# EAGLE design bblan95xx (EAGLE 7.6.0)
CNAME: LAN95XX base board adapter; CREVISION: Rev. 0.1 alpha; DESIGNER: Stephan Baerwolf
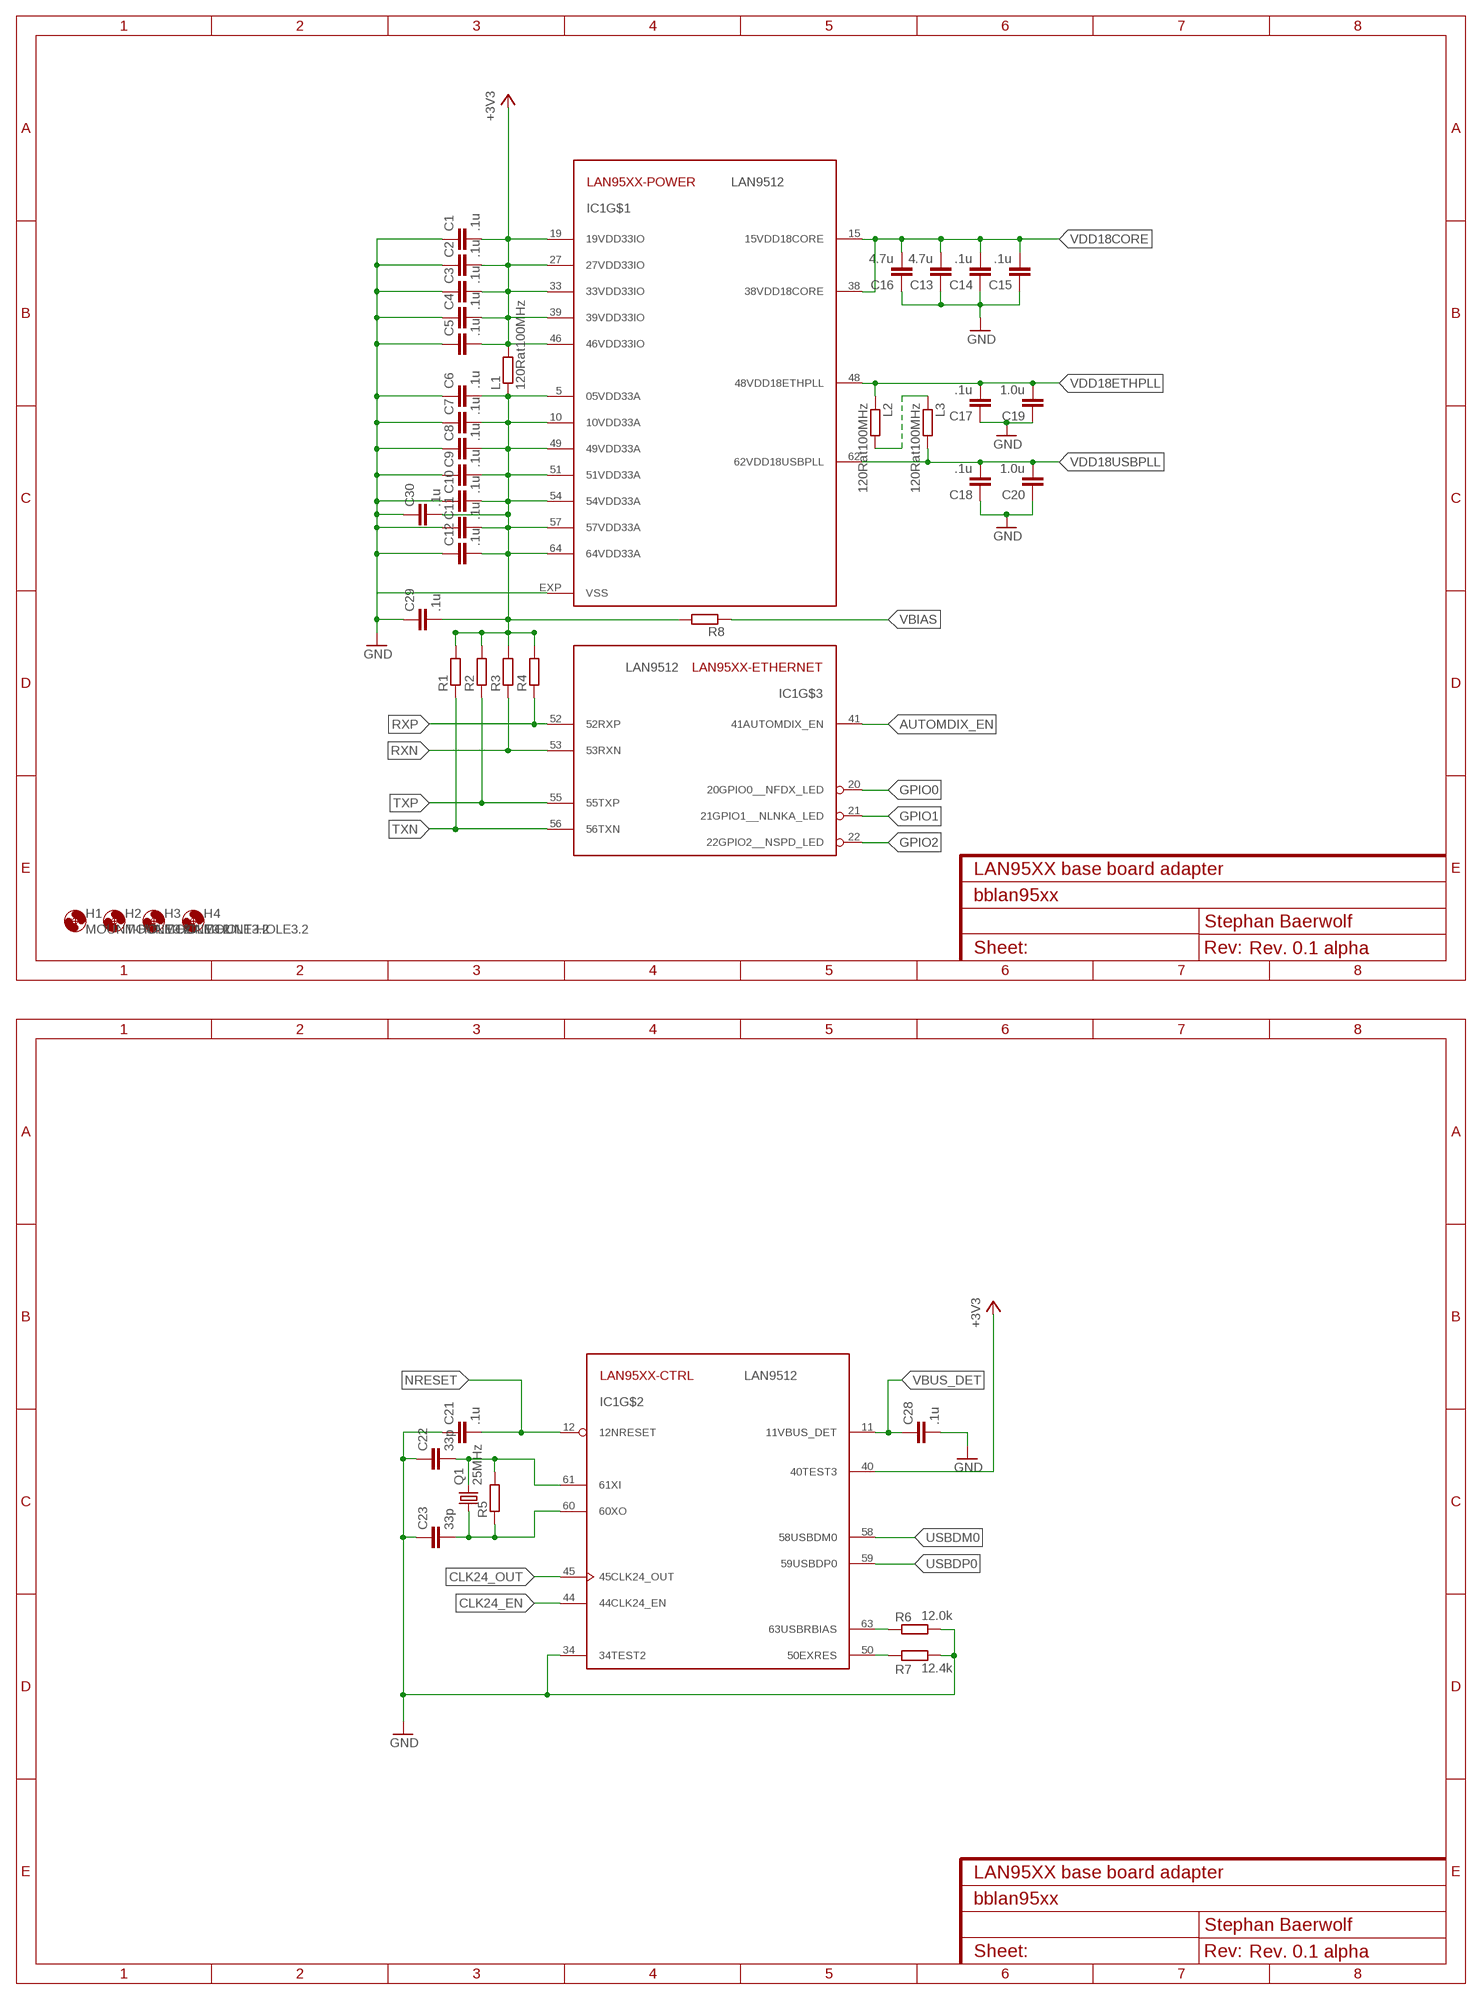
[diagram p0: schematic, sheet 1, part 1 of 2]
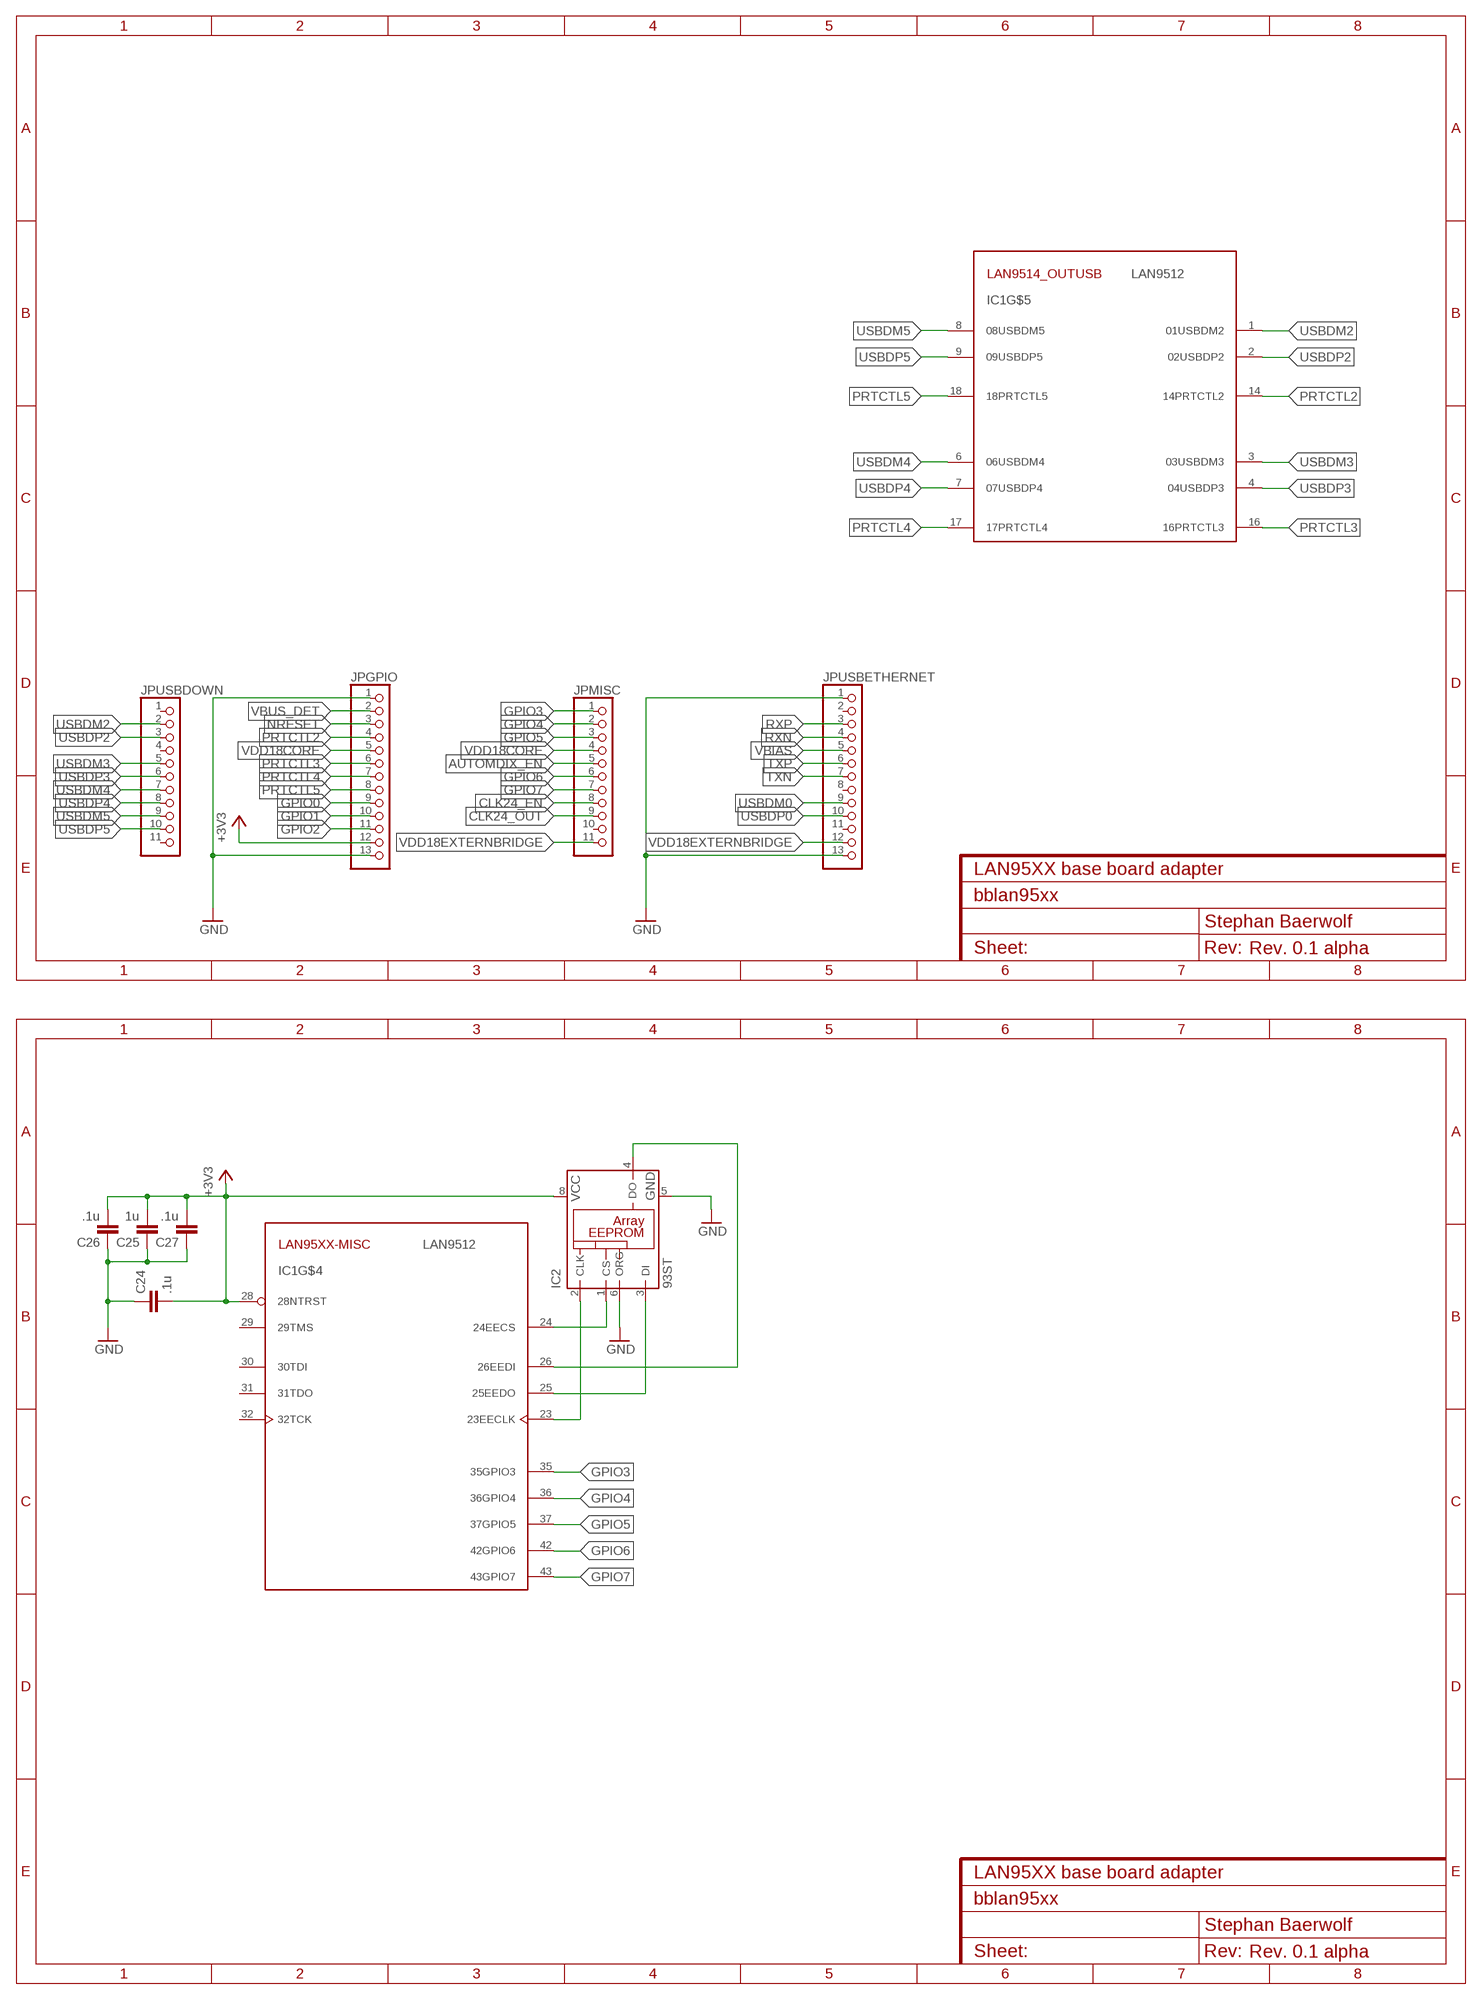
[diagram p1: schematic, sheet 1, part 2 of 2]
FRAME1 (FRAME-A4L): MYSHEET: 1/4
FRAME2 (FRAME-A4L): MYSHEET: 2/4
FRAME3 (FRAME-A4L): MYSHEET: 3/4
FRAME4 (FRAME-A4L): MYSHEET: 4/4

## Parts
C1  .1u  C-EUC0805K  [C0805K]
C2  .1u  C-EUC0805K  [C0805K]
C3  .1u  C-EUC0805K  [C0805K]
C4  .1u  C-EUC0805K  [C0805K]
C5  .1u  C-EUC0805K  [C0805K]
C6  .1u  C-EUC0805K  [C0805K]
C7  .1u  C-EUC0805K  [C0805K]
C8  .1u  C-EUC0805K  [C0805K]
C9  .1u  C-EUC0603K  [C0603K]
C10  .1u  C-EUC0603K  [C0603K]
C11  .1u  C-EUC0603K  [C0603K]
C12  .1u  C-EUC0805K  [C0805K]
C13  4.7u  C-EUC0805K  [C0805K]
C14  .1u  C-EUC0603K  [C0603K]
C15  .1u  C-EUC0603K  [C0603K]
C16  4.7u  C-EUC0805K  [C0805K]
C17  .1u  C-EUC0603K  [C0603K]
C18  .1u  C-EUC0603K  [C0603K]
C19  1.0u  C-EUC0805K  [C0805K]
C20  1.0u  C-EUC0805K  [C0805K]
C21  .1u  C-EUC0603K  [C0603K]
C22  33p  C-EUC0603K  [C0603K]
C23  33p  C-EUC0603K  [C0603K]
C24  .1u  C-EUC0603K  [C0603K]
C25  1u  C-EUC0805K  [C0805K]
C26  .1u  C-EUC0805K  [C0805K]
C27  .1u  C-EUC0805K  [C0805K]
C28  .1u  C-EUC0603K  [C0603K]
C29  .1u  C-EUC0603K  [C0603K]
C30  .1u  C-EUC0603K  [C0603K]
H1  MOUNT-HOLE3.2  [3,2]
H2  MOUNT-HOLE3.2  [3,2]
H3  MOUNT-HOLE3.2  [3,2]
H4  MOUNT-HOLE3.2  [3,2]
IC1  LAN9512  LAN95XX  [QFN64-9X9-EXTRALONG]
IC2  93ST  93LC66SN  [SO-08]
JPGPIO  PINHD-1X13  [1X13]
JPMISC  PINHD-1X11  [1X11]
JPUSBDOWN  PINHD-1X11  [1X11]
JPUSBETHERNET  PINHD-1X13  [1X13]
L1  120Rat100MHz  R-EU_R0805  [R0805]
L2  120Rat100MHz  R-EU_R0805  [R0805]
L3  120Rat100MHz  R-EU_R0805  [R0805]
Q1  25MHz  CRYSTAL5X3  [CRYSTAL-SMD-5X3]
R1  R-EU_R0603  [R0603]
R2  R-EU_R0603  [R0603]
R3  R-EU_R0603  [R0603]
R4  R-EU_R0603  [R0603]
R5  R-EU_R0603  [R0603]
R6  12.0k  R-EU_R0603  [R0603]
R7  12.4k  R-EU_R0603  [R0603]
R8  R-EU_R0402  [R0402]

## Nets
+3V3: C1.2 C2.2 C3.2 C4.2 C5.2 C24.2 C25.2 C26.2 C27.2 IC1.19(19VDD33IO) IC1.27(27VDD33IO) IC1.28(28NTRST) IC1.33(33VDD33IO) IC1.39(39VDD33IO) IC1.40(40TEST3) IC1.46(46VDD33IO) IC2.8(VCC) JPGPIO.12 L1.2
AUTOMDIX_EN: IC1.41(41AUTOMDIX_EN) JPMISC.5
CLK24_EN: IC1.44(44CLK24_EN) JPMISC.8
CLK24_OUT: IC1.45(45CLK24_OUT) JPMISC.9
EECLK: IC1.23(23EECLK) IC2.2(CLK)
EECS: IC1.24(24EECS) IC2.1(CS)
EEDI: IC1.26(26EEDI) IC2.4(DO)
EEDO: IC1.25(25EEDO) IC2.3(DI)
GND: C1.1 C2.1 C3.1 C4.1 C5.1 C6.1 C7.1 C8.1 C9.1 C10.1 C11.1 C12.1 C13.1 C14.1 C15.1 C16.1 C17.1 C18.1 C19.1 C20.1 C21.1 C22.1 C23.1 C24.1 C25.1 C26.1 C27.1 C28.2 C29.1 C30.1 IC1.34(34TEST2) IC1.EXP(VSS) IC2.5(GND) IC2.6(ORG) JPGPIO.1 JPGPIO.13 JPUSBETHERNET.1 JPUSBETHERNET.13 R6.2 R7.2
GPIO0: IC1.20(20GPIO0__NFDX_LED) JPGPIO.9
GPIO1: IC1.21(21GPIO1__NLNKA_LED) JPGPIO.10
GPIO2: IC1.22(22GPIO2__NSPD_LED) JPGPIO.11
GPIO3: IC1.35(35GPIO3) JPMISC.1
GPIO4: IC1.36(36GPIO4) JPMISC.2
GPIO5: IC1.37(37GPIO5) JPMISC.3
GPIO6: IC1.42(42GPIO6) JPMISC.6
GPIO7: IC1.43(43GPIO7) JPMISC.7
N$5: IC1.63(63USBRBIAS) R6.1
N$6: IC1.50(50EXRES) R7.1
NRESET: C21.2 IC1.12(12NRESET) JPGPIO.3
PRTCTL2: IC1.14(14PRTCTL2) JPGPIO.4
PRTCTL3: IC1.16(16PRTCTL3) JPGPIO.6
PRTCTL4: IC1.17(17PRTCTL4) JPGPIO.7
PRTCTL5: IC1.18(18PRTCTL5) JPGPIO.8
RXN: IC1.53(53RXN) JPUSBETHERNET.4 R3.1
RXP: IC1.52(52RXP) JPUSBETHERNET.3 R4.1
TXN: IC1.56(56TXN) JPUSBETHERNET.7 R1.1
TXP: IC1.55(55TXP) JPUSBETHERNET.6 R2.1
USBDM0: IC1.58(58USBDM0) JPUSBETHERNET.9
USBDM2: IC1.1(01USBDM2) JPUSBDOWN.2
USBDM3: IC1.3(03USBDM3) JPUSBDOWN.5
USBDM4: IC1.6(06USBDM4) JPUSBDOWN.7
USBDM5: IC1.8(08USBDM5) JPUSBDOWN.9
USBDP0: IC1.59(59USBDP0) JPUSBETHERNET.10
USBDP2: IC1.2(02USBDP2) JPUSBDOWN.3
USBDP3: IC1.4(04USBDP3) JPUSBDOWN.6
USBDP4: IC1.7(07USBDP4) JPUSBDOWN.8
USBDP5: IC1.9(09USBDP5) JPUSBDOWN.10
VBIAS: JPUSBETHERNET.5 R8.1
VBUS_DET: C28.1 IC1.11(11VBUS_DET) JPGPIO.2
VDD18CORE: C13.2 C14.2 C15.2 C16.2 IC1.15(15VDD18CORE) IC1.38(38VDD18CORE) JPGPIO.5 JPMISC.4
VDD18ETHPLL: C17.2 C19.2 IC1.48(48VDD18ETHPLL) L2.1
VDD18EXTERNBRIDGE: JPMISC.11 JPUSBETHERNET.12 L2.2 L3.1
VDD18USBPLL: C18.2 C20.2 IC1.62(62VDD18USBPLL) L3.2
VDD33A: C6.2 C7.2 C8.2 C9.2 C10.2 C11.2 C12.2 C29.2 C30.2 IC1.5(05VDD33A) IC1.10(10VDD33A) IC1.49(49VDD33A) IC1.51(51VDD33A) IC1.54(54VDD33A) IC1.57(57VDD33A) IC1.64(64VDD33A) L1.1 R1.2 R2.2 R3.2 R4.2 R8.2
XI: C22.2 IC1.61(61XI) Q1.3 R5.2
XO: C23.2 IC1.60(60XO) Q1.1 R5.1
Unconnected: IC1.29(29TMS) IC1.30(30TDI) IC1.31(31TDO) IC1.32(32TCK) IC2.7(NU) JPMISC.10 JPUSBDOWN.1 JPUSBDOWN.4 JPUSBDOWN.11 JPUSBETHERNET.2 JPUSBETHERNET.8 JPUSBETHERNET.11

## Library data of the parts
C1-C30 = resistor:C-EU: CAPACITOR, European symbol; SPICEPREFIX: C
H1-H4 = holes:MOUNT-HOLE: MOUNTING HOLE with drill center marker
IC1 = LAN95XX:LAN95XX
IC2 = microchip:93*: Serial EPROM 1 K/2 K/4 K, low voltage, Microwire; MF: MICROCHIP; MPN: 93LC66/SN; OC_FARNELL: 1296586; OC_NEWARK: 65K1154
JPGPIO JPUSBETHERNET = pinhead:PINHD-1X13: PIN HEADER
JPMISC JPUSBDOWN = pinhead:PINHD-1X11: PIN HEADER
L1-L3 R1-R8 = resistor:R-EU_: RESISTOR, European symbol; SPICEPREFIX: R
Q1 = SparkFun:CRYSTAL: Crystals Various standard crystals. Proven footprints. Spark Fun Electronics SKU : COM-00534

## Board
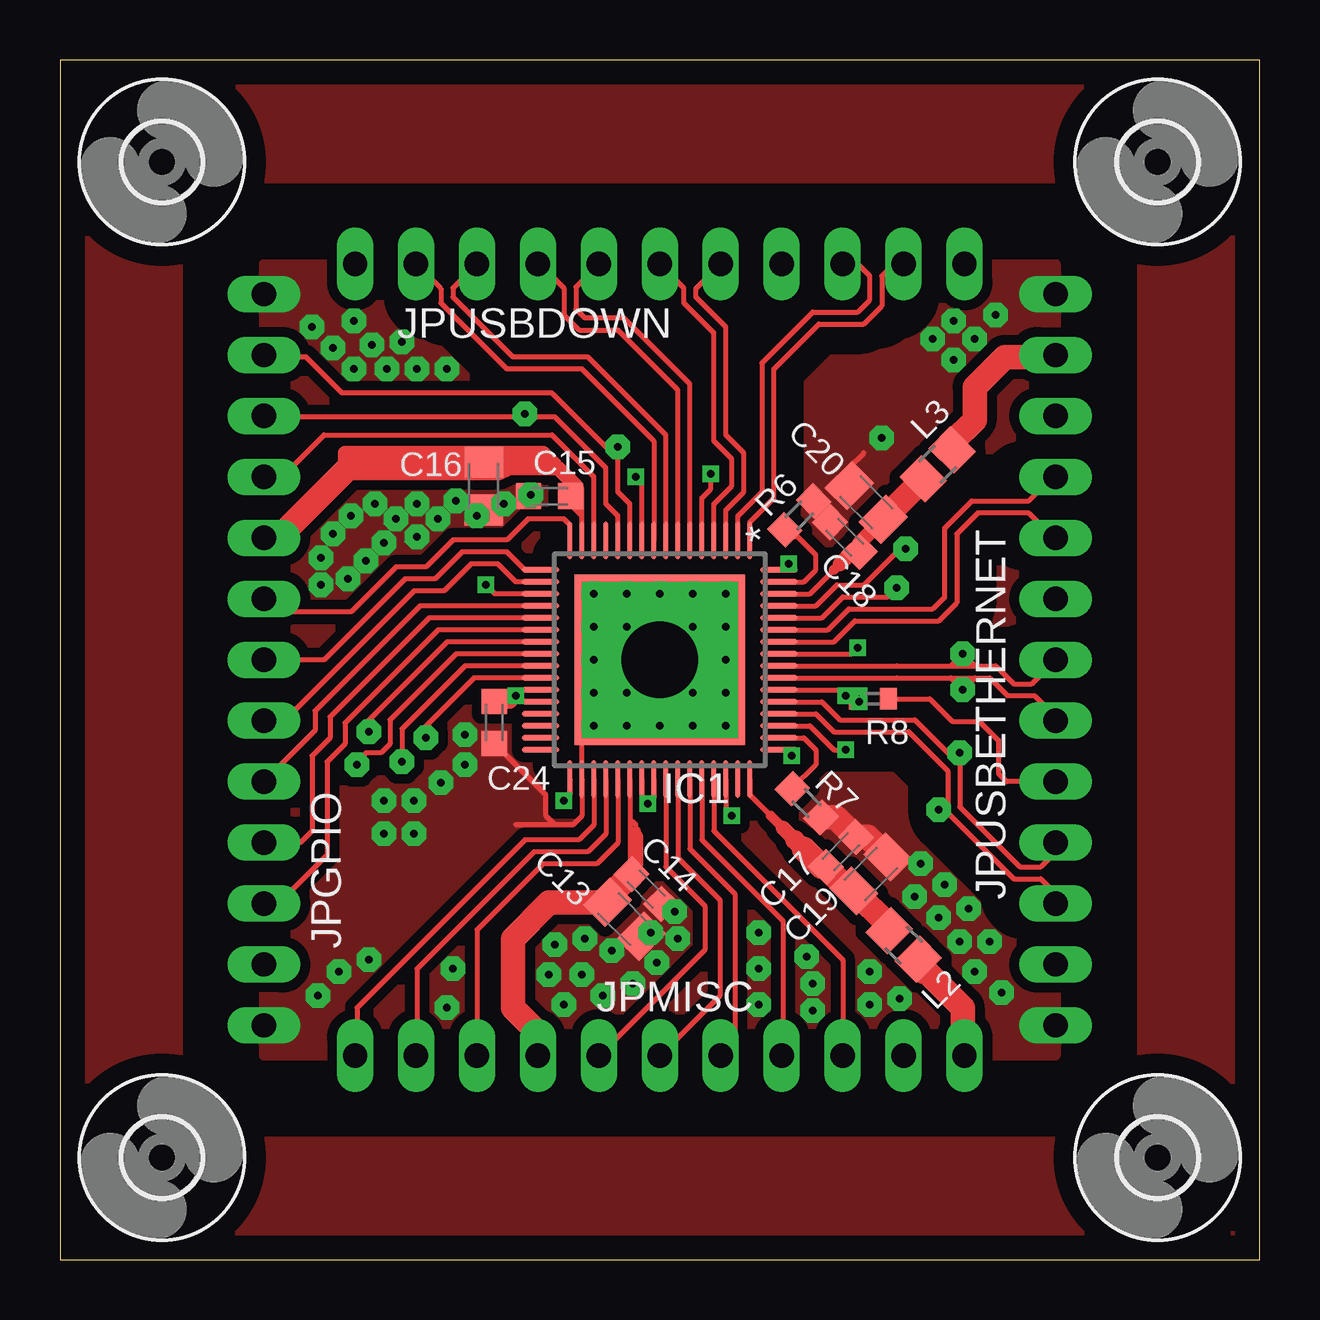
[diagram p2: board, top side]
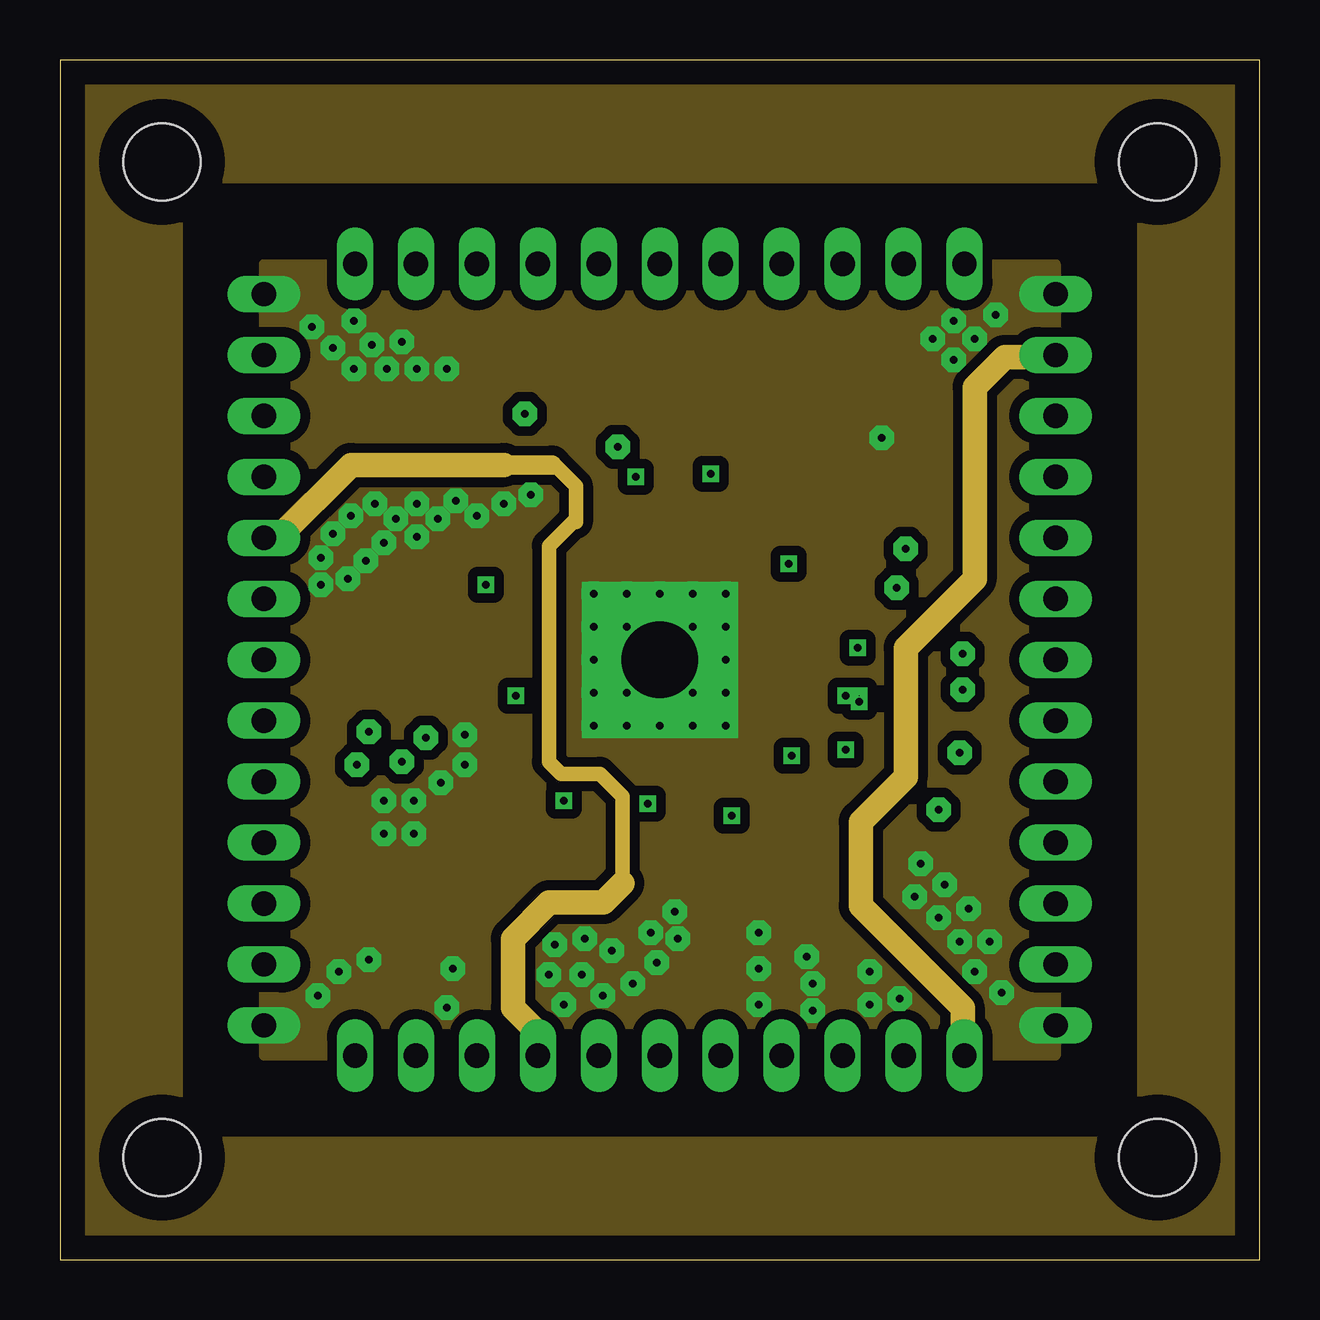
[diagram p3: board, inner layer PCBnoRoute]
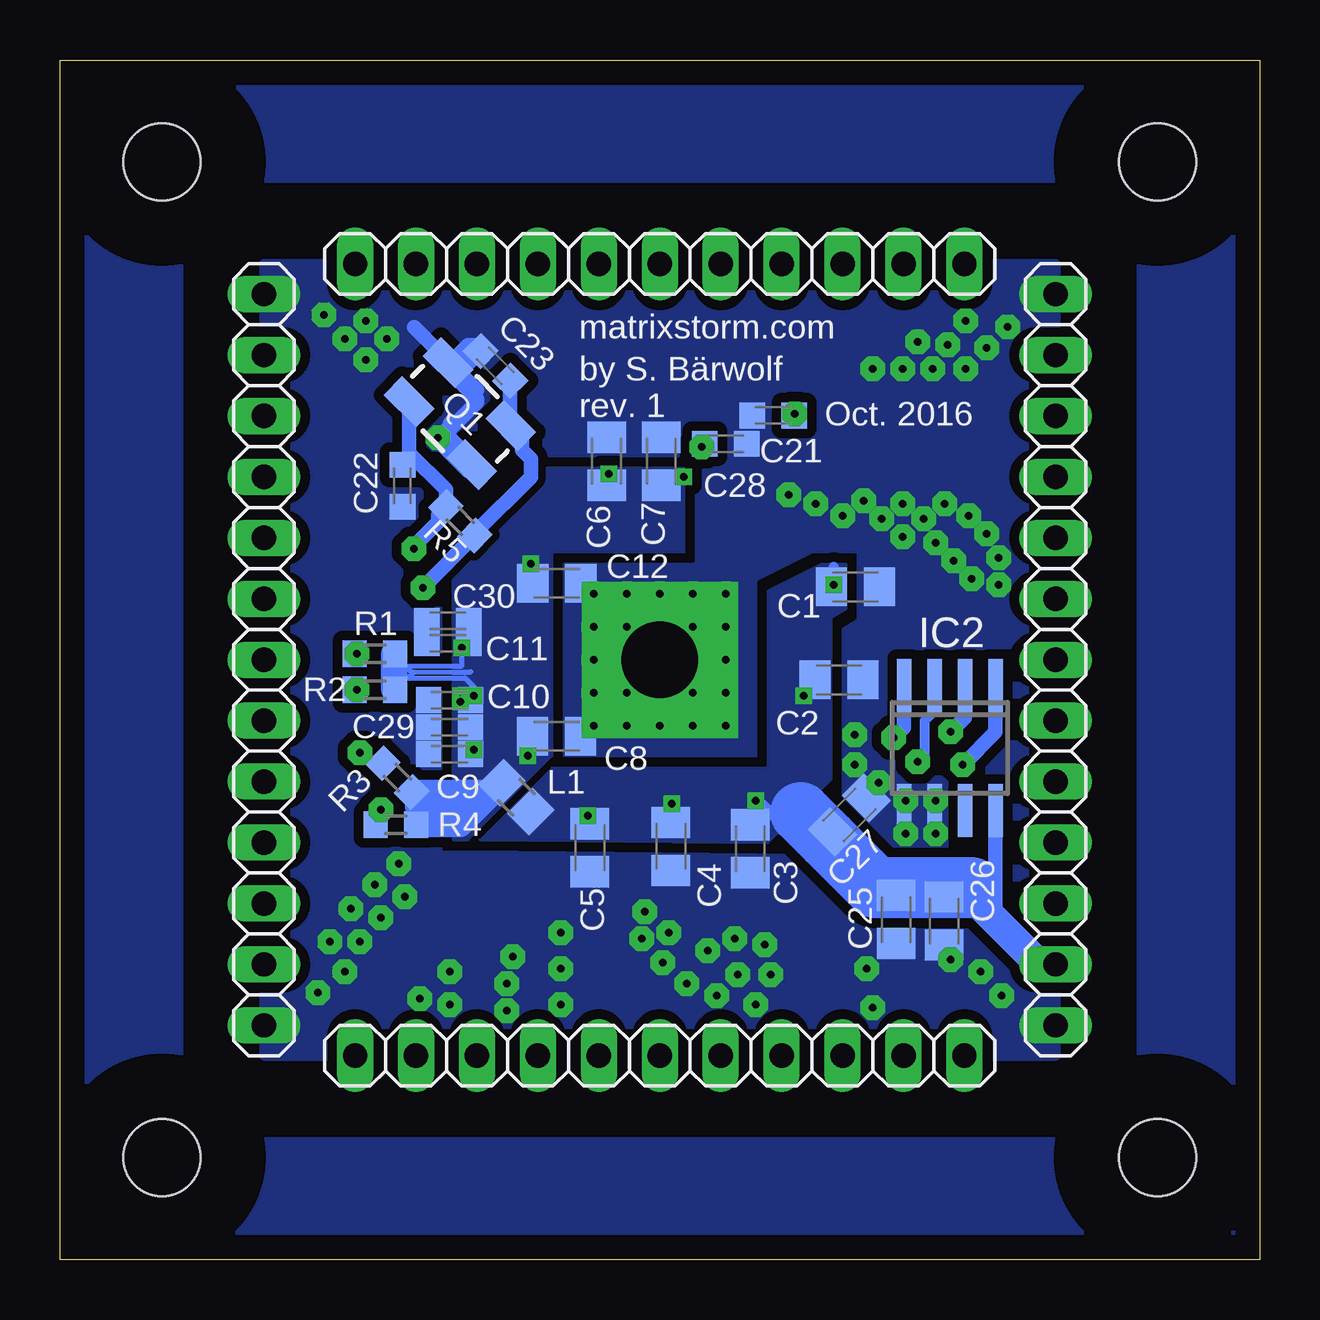
[diagram p4: board, bottom side, seen from below]

Size 50 x 50 mm. Coordinates in mm from the lower left corner, seen from the top.
Outline: 0,0 50,0 50,50 0,50 0,0
Copper layers (1*14*16): Top 0.035mm / dielectric 0.45mm / PCBnoRoute 0.035mm / dielectric 0.15mm / Bottom 0.035mm
Design rules "default *": minimum track width 10mil, minimum drill 24mil, track to track 8mil, track to pad 8mil, pad to pad 8mil, via to via 8mil, smd to smd 8mil, copper to edge 40mil, drill to drill 8mil, minimum pad ring 10mil, minimum via ring 8mil, stop-mask expansion 4mil, vias tented up to drill 0mil, thermal gap 10mil
tRestrict: 52 lines

### Footprints (pad centres in the part's own frame; a part is rotated, then mirrored left to right if it is on the bottom)
C0805K = smd 1.3 x 1.6: 1 -1,0; 2 1,0
C0603K = smd 1.05 x 1.08: 1 -0.875,0; 2 0.875,0
3,2 = hole 3.2: 0,0
QFN64-9X9-EXTRALONG = smd 1.55 x 0.2: 1 -4.977,3.75; 2 -4.977,3.25; 3 -4.977,2.75; 4 -4.977,2.25; 5 -4.977,1.75; 6 -4.977,1.25; 7 -4.977,0.75; 8 -4.977,0.25; 9 -4.977,-0.25; 10 -4.977,-0.75; 11 -4.977,-1.25; 12 -4.977,-1.75; 13 -4.977,-2.25; 14 -4.977,-2.75; 15 -4.977,-3.25; 16 -4.977,-3.75; 33 4.977,-3.75; 34 4.977,-3.25; 35 4.977,-2.75; 36 4.977,-2.25; 37 4.977,-1.75; 38 4.977,-1.25; 39 4.977,-0.75; 40 4.977,-0.25; 41 4.977,0.25; 42 4.977,0.75; 43 4.977,1.25; 44 4.977,1.75; 45 4.977,2.25; 46 4.977,2.75; 47 4.977,3.25; 48 4.977,3.75 | smd 0.2 x 1.55: 17 -3.75,-4.977; 18 -3.25,-4.977; 19 -2.75,-4.977; 20 -2.25,-4.977; 21 -1.75,-4.977; 22 -1.25,-4.977; 23 -0.75,-4.977; 24 -0.25,-4.977; 25 0.25,-4.977; 26 0.75,-4.977; 27 1.25,-4.977; 28 1.75,-4.977; 29 2.25,-4.977; 30 2.75,-4.977; 31 3.25,-4.977; 32 3.75,-4.977; 49 3.75,4.977; 50 3.25,4.977; 51 2.75,4.977; 52 2.25,4.977; 53 1.75,4.977; 54 1.25,4.977; 55 0.75,4.977; 56 0.25,4.977; 57 -0.25,4.977; 58 -0.75,4.977; 59 -1.25,4.977; 60 -1.75,4.977; 61 -2.25,4.977; 62 -2.75,4.977; 63 -3.25,4.977; 64 -3.75,4.977 | smd 7.1 x 7.1: EXP 0,0
SO-08 = smd 0.6 x 2.2: 1 -1.905,-2.6; 2 -0.635,-2.6; 3 0.635,-2.6; 4 1.905,-2.6; 5 1.905,2.6; 6 0.635,2.6; 7 -0.635,2.6; 8 -1.905,2.6
1X13 = drill 1.016 long: 1 -15.24,0; 2 -12.7,0; 3 -10.16,0; 4 -7.62,0; 5 -5.08,0; 6 -2.54,0; 7 0,0; 8 2.54,0; 9 5.08,0; 10 7.62,0; 11 10.16,0; 12 12.7,0; 13 15.24,0
1X11 = drill 1.016 long: 1 -12.7,0; 2 -10.16,0; 3 -7.62,0; 4 -5.08,0; 5 -2.54,0; 6 0,0; 7 2.54,0; 8 5.08,0; 9 7.62,0; 10 10.16,0; 11 12.7,0
R0805 = smd 1.3 x 1.5: 1 -0.85,0; 2 0.85,0
CRYSTAL-SMD-5X3 = smd 1.9 x 1.1: 1 -1.85,-1.15; 2 1.85,-1.15; 3 1.85,1.15; 4 -1.85,1.15
R0603 = smd 1 x 1.1: 1 -0.85,0; 2 0.85,0
R0402 = smd 0.7 x 0.9: 1 -0.65,0; 2 0.65,0

### Placement (x,y rotation side)
C1  16.84,28.04 180 bottom
C2  17.53,24.16 180 bottom
C3  21.23,17.12 90 bottom
C4  24.54,17.23 90 bottom
C5  27.91,17.16 90 bottom
C6  27.21,33.27 270 bottom
C7  24.94,33.27 270 bottom
C8  29.3,21.81 180 bottom
C9  33.77,21.07 0 bottom
C10  33.77,23.32 0 bottom
C11  33.83,25.69 0 bottom
C12  29.29,28.18 180 bottom
C13  23.52,14.19 135 top
C14  24.44,15.44 135 top
C15  20.41,31.82 0 top
C16  17.66,32.23 90 top
C17  32.55,16.99 225 top
C18  32.71,30.11 315 top
C19  33.8,16.07 225 top
C20  33.61,31.56 315 top
C21  20.27,35.19 0 bottom
C22  35.73,32.25 90 bottom
C23  31.85,37.25 315 bottom
C24  18.11,22.39 90 top
C25  15.14,14.18 90 bottom
C26  13.14,14.11 90 bottom
C27  17.09,18.54 225 bottom
C28  22.25,34 0 bottom
C29  33.77,22.19 0 bottom
C30  33.83,26.62 0 bottom
H1  4.25,45.75 0 top
H2  45.75,45.75 0 top
H3  4.25,4.25 0 top
H4  45.75,4.25 0 top
IC1  25,25 270 top
IC2  12.91,21.32 180 bottom
JPGPIO  8.5,25 270 bottom
JPMISC  25,8.5 180 bottom
JPUSBDOWN  25,41.5 0 bottom
JPUSBETHERNET  41.5,25 90 bottom
L1  30.97,19.27 315 bottom
L2  35.16,13.11 315 top
L3  36.59,33.14 225 top
Q1  33.33,35.26 135 bottom
R1  36.88,25.25 0 bottom
R2  36.88,23.75 0 bottom
R3  35.94,20.09 315 bottom
R4  36,18.12 0 bottom
R5  33.31,30.78 135 bottom
R6  30.81,31.01 45 top
R7  31.12,19.03 315 top
R8  33.88,23.38 180 top

### Tracks (layer width: path | path; a pad name or v marks a point on that pad's centre or on a via)
+3V3  (via drill 0.3)
  Top 0.2: IC1.19 18.12,27.75 v17.75,28.12 | IC1.40 24.75,19.25 v24.5,19 24.25,19.25 IC1.39 | IC1.33 21.25,19.38 v21,19.12 | IC1.46 27.75,18.75 v28,18.5 | IC1.27 19.25,23.75 v19,23.5 19.25,23.25 IC1.28
  Top 0.61: C24.2 18.76,23.26 v19,23.5
  Bottom 0.2: C26.2 12.39,14.98 12,15.38 | C25.2 15.3,15.18 15.62,15.5
  Bottom 0.406: 17.75,28.88 v17.75,28.12
  Bottom 0.61: 19.12,18.62 20.5,18.62 v21,19.12 | IC2.8 11.01,14.74 11.31,14.44 | C27.2 18,17.62 18,17.5 | 17.75,27.82 C1.2
  Bottom 1.27: JPGPIO.12 9.18,12.3 11.31,14.44 12,15.12 12,15.38 12,15.5
  Bottom 2.54: 12,15.5 15.62,15.5 16,15.5 18,17.5 19.12,18.62
  pour Bottom (isolate 0.305, no thermals): 20.5,27.88 18.25,29 17.25,29 17.25,27.12 17.88,26.75 17.88,20 20.5,17.38 32.5,17.5 29.5,20.5 20.5,20.5
AUTOMDIX_EN
  Top 0.2: IC1.41 25.25,16.38 26.88,14.75 26.88,12.91 JPMISC.5
CLK24_EN
  Top 0.2: IC1.44 26.75,17.5 30.12,14.12 30.12,8.54 JPMISC.8
CLK24_OUT
  Top 0.2: IC1.45 27.25,17.88 32.62,12.5 JPMISC.9
EECLK  (via drill 0.3 pad 1.02)
  Top 0.2: IC1.23 16.12,25.75 12.88,22.5 v12.88,22
  Bottom 0.61: IC2.2 12.28,22.6 v12.88,22
EECS  (via drill 0.3 pad 1.02)
  Top 0.2: IC1.24 16.5,25.25 13.75,22.5 13.75,21.5 13.38,21.12 12.75,21.12 12.38,20.75 v12.38,20.62
  Bottom 0.61: IC2.1 11.01,22 v12.38,20.62
EEDI  (via drill 0.3 pad 1.02)
  Top 0.2: IC1.26 17.25,24.25 15.12,22.12 15.12,21.88 v15.25,21.75
  Bottom 0.61: IC2.4 14.81,22.18 v15.25,21.75
EEDO  (via drill 0.3 pad 1.02)
  Top 0.2: IC1.25 16.88,24.75 14.25,22.12 v14.25,20.75
  Bottom 0.2: 13.62,23.38 13.54,23.45 IC2.3 13.54,22.95
  Bottom 0.406: v14.25,20.75 13.95,21.05 13.95,22.46 13.54,22.87 13.54,22.95
GND  (via drill 0.3 pad 1.02, 3.2 pad 6.5)
  Top 0.2: IC1.EXP 21.75,21.75 IC1.34 21.75,18.5 21.38,18.12 20.62,18.12 | 20.62,18.12 20.25,18.5 20.25,19.36 C24.1 | 20.62,18.12 19,18.12 | C20.1 32.9,33.02 33.5,33.62
  Top 0.61: R6.2 31.41,31.41 C18.1
  Top 1.016: R7.2 32.35,18.43 C17.1 33.68,17.61 C19.1 34.51,16.74
  Bottom 0.61: 33.75,34.88 33.75,34.75 34,34.5 | 34,34.5 v34.25,34.25 | 33,32.88 34.25,34.12 32.62,35.75 32.62,35.88 33.5,36.75 33.5,36.84 C23.1 32.72,38.12 33,38.12 33.5,37.62 | 33.25,33.75 34,34.5 | 35.25,38.88 34.12,37.75 | 32.62,36.25 33.38,37
  other vias: 25,25 35.62,15.12 33.75,10.62 31.38,11.5 29.12,12.12 25.75,13.38 24.62,13.62 25.62,14.5 24.88,12.38 23,12.88 21.75,11.88 13.5,17.75 19.62,31.88 18.5,31.5 17.38,31 14,30.88 16.5,31.62 13.5,29.88 15.75,30.88 13.12,31.5 12.12,31 10.88,29.25 12.75,29.12 11.38,30.25 21.88,13.38 20.62,13.12 20.38,11.88 23.88,11.5 21,10.62 22.62,11 10.88,28.12 14.88,31.5 14.88,30.12 12,28.38 29.12,13.62 29.12,10.62 31.12,12.62 31.38,10.38 16.38,12.12 16.12,10.5 33.75,12 35,10.88 11.62,12 10.75,11 12.88,12.5 14.75,17.75 15.88,19.88 16.88,21.88 16.88,20.62 13.5,19.12 14.75,19.12 16.12,37.12 14.88,37.12 13.62,37.12 12.25,37.12 11.38,38 10.5,38.88 13,38.12 12.25,39.12 14.25,38.25 36.38,38.38 37.25,37.5 37.25,39.12 38.12,38.38 39,39.38 35.88,16.5 36.88,15.62 36.62,14.25 37.88,14.62 37.5,13.25 38.75,13.25 38.12,12 39.25,11.12 22.25,27.75 23.62,27.75 25,27.75 26.38,27.75 27.75,27.75 22.25,26.38 23.62,26.38 26.38,26.38 27.75,26.38 22.25,25 22.25,23.62 22.25,22.25 27.75,25 23.62,23.62 26.38,23.62 27.75,23.62 23.62,22.25 25,22.25 26.38,22.25 27.75,22.25
  pour Bottom (isolate 0.406, rank 6, no thermals): 8.5,41.5 41.5,41.5 41.5,8.5 8.5,8.5
  pour Top (isolate 0.406, rank 6, no thermals): 8.5,41.5 41.5,41.5 41.5,8.5 8.5,8.5
  pour PCBnoRoute (isolate 0.406, rank 6, no thermals): 8.5,41.5 41.5,41.5 41.5,8.5 8.5,8.5
  pour PCBnoRoute (isolate 0.254, rank 6, no thermals): 5,50 0,50 0,0 50,0 50,50 5,50 5,45 45,45 45,5 5,5
  pour Bottom (isolate 0.254, rank 6, no thermals): 5,50 0,50 0,0 50,0 50,50 5,50 5,45 45,45 45,5 5,5
  pour Top (isolate 0.254, rank 6, no thermals): 5,50 0,50 0,0 50,0 50,50 5,50 5,45 45,45 45,5 5,5
GPIO0
  Top 0.2: IC1.20 15,27.25 10.62,22.88 10.62,22.05 JPGPIO.9
GPIO1
  Top 0.2: IC1.21 15.38,26.75 11.25,22.62 11.25,21.75 10.5,21 10.5,17.88 10,17.38 JPGPIO.10
GPIO2
  Top 0.2: IC1.22 15.75,26.25 11.88,22.38 11.88,21.5 11.12,20.75 11.12,16.88 9.12,14.88 8.54,14.88 JPGPIO.11
GPIO3
  Top 0.2: IC1.35 22.25,18.12 21.62,17.5 19.38,17.5 12.38,10.5 12.38,8.57 JPMISC.1
GPIO4
  Top 0.2: IC1.36 22.75,17.75 22,17 19.75,17 14.88,12.12 14.88,8.54 JPMISC.2
GPIO5
  Top 0.2: IC1.37 23.25,17.38 22.38,16.5 20.12,16.5 17.38,13.75 JPMISC.3
GPIO6
  Top 0.2: IC1.42 25.75,16.75 27.5,15 27.5,11 JPMISC.6
GPIO7
  Top 0.2: IC1.43 26.25,17.12 28.12,15.25 28.12,9.09 JPMISC.7
N$1  (via drill 0.8 pad 2.54)
  other vias: 4.25,45.75
N$2
  Top 0.2: 34.5,23.62 34.38,23.62 34.38,23.5
N$5
  Top 0.2: IC1.63 31,28.25 31.5,28.75 31.5,29.38 30.75,30.12 30.5,30.12 R6.1
N$6
  Top 0.2: IC1.50 31,21.75 31.5,21.25 31.5,20.62 30.52,19.64 R7.1
N$7
  Bottom 0.61: 41.25,37.5 41.75,37.5
N$22  (via drill 0.8 pad 2.54)
  other vias: 45.75,45.75
N$23  (via drill 0.8 pad 2.54)
  other vias: 45.75,4.25
N$24  (via drill 0.8 pad 2.54)
  other vias: 4.25,4.25
N$25
  Top 0.2: 29.88,24.75 34.88,24.75
N$26
  Top 0.2: 29.88,24.25 34.88,24.25
N$27
  Top 0.2: 30.12,21.25 30.75,21.25
NRESET  (via drill 0.3 pad 1.02)
  Top 0.2: IC1.12 23.25,31 22.75,31.5 22.75,33 20.62,35.12 19,35.12 | 19,35.12 v19.38,35.25 | 19,35.12 8.54,35.12 JPGPIO.3
  Bottom 0.2: 19.44,35.19 C21.2 19.19,35.19 v19.38,35.25
PRTCTL2
  Top 0.2: IC1.14 22.25,32.62 20.5,34.38 11,34.38 9.25,32.62 JPGPIO.4
PRTCTL3
  Top 0.2: IC1.16 21.25,30.62 21,30.88 19.5,30.88 18.62,30 16.38,30 15.25,28.88 14,28.88 12.12,27 9.04,27 JPGPIO.6
PRTCTL4
  Top 0.2: IC1.17 19.38,28.75 18.62,29.5 16.75,29.5 15.62,28.38 14.38,28.38 11,25 JPGPIO.7
PRTCTL5
  Top 0.2: IC1.18 19,28.25 18.25,29 17.12,29 16,27.88 14.75,27.88 9.38,22.5 8.54,22.5 JPGPIO.8
RXN  (via drill 0.3 pad 1.02)
  Top 0.2: IC1.53 31.75,23.25 32.5,22.5 35.62,22.5 37,21.12 | 37,21.12 37.5,20.62 | 37.5,20.62 37.5,18.88 40,16.38 40.88,16.38 41.25,16.75 41.25,17.13 JPUSBETHERNET.4 | 37.5,20.62 v37.5,21.12 37,21.12
  Bottom 0.2: 36.81,20.69 R3.1 36.56,20.69 v37.5,21.12
RXP  (via drill 0.3 pad 1.02)
  Top 0.2: IC1.52 31.5,22.75 32.25,22 35.38,22 37,20.38 37,19.12 | 37,19.12 37,18.62 | 37,18.62 39.75,15.88 40.88,15.88 41.25,15.5 41.25,15.09 JPUSBETHERNET.3 | 37,18.62 36.88,18.75 v36.62,18.75 37,19.12
  Bottom 0.2: R4.1 36.85,18.52 v36.62,18.75
TXN  (via drill 0.3 pad 1.02)
  Top 0.2: IC1.56 37.12,24.75 | 37.12,24.75 38.12,24.75 | 37.12,24.75 v37.62,25.25 38.12,24.75 | 38.12,24.75 39,24.75 39.75,24 40.5,24 JPUSBETHERNET.7
  Bottom 0.2: R1.1 v37.62,25.25
TXP  (via drill 0.3 pad 1.02)
  Top 0.2: IC1.55 37.12,24.25 | 37.12,24.25 38.12,24.25 | 37.12,24.25 v37.62,23.75 38.12,24.25 | 38.12,24.25 38.75,24.25 39.5,23.5 40.62,23.5 41.5,22.62 JPUSBETHERNET.6
  Bottom 0.2: 38.12,23.48 R2.1 v37.62,23.75
USBDM0
  Top 0.2: IC1.58 32.25,25.75 33.12,26.62 36.62,26.62 37.38,27.38 37.38,30.25 38.25,31.12 40.38,31.12 41.42,30.08 JPUSBETHERNET.9
USBDM2
  Top 0.2: IC1.1 28.75,30.75 29.75,31.75 29.75,37.12 31.62,39 33.5,39 34.25,39.75 34.25,41 34.75,41.5 JPUSBDOWN.2
USBDM3
  Top 0.2: IC1.3 27.75,31.25 28.5,32 28.5,33.62 27.75,34.38 27.75,38.88 26.5,40.12 26.5,40.46 JPUSBDOWN.5
USBDM4
  Top 0.2: IC1.6 26.25,36.5 23.5,39.25 21.88,39.25 21.5,39.62 21.5,40.54 JPUSBDOWN.7
USBDM5
  Top 0.2: IC1.8 25.25,34.38 22,37.62 18.88,37.62 16.38,40.12 16.38,40.49 JPUSBDOWN.9
USBDP0
  Top 0.2: IC1.59 32,26.25 32.88,27.12 36.38,27.12 36.88,27.62 36.88,30.5 38,31.62 40.38,31.62 41.37,32.62 JPUSBETHERNET.10
USBDP2
  Top 0.2: IC1.2 28.25,31 29.25,32 29.25,37.38 31.38,39.5 33.25,39.5 33.75,40 33.75,41 33.25,41.5 JPUSBDOWN.3
USBDP3
  Top 0.2: IC1.4 27.25,31.5 28,32.25 28,33.38 27.25,34.12 27.25,38.62 26,39.88 26,40.5 JPUSBDOWN.6
USBDP4
  Top 0.2: IC1.7 25.75,36.25 23.25,38.75 21.62,38.75 21,39.38 21,40.5 20,41.5 JPUSBDOWN.8
USBDP5
  Top 0.2: IC1.9 24.75,34.12 21.75,37.12 18.62,37.12 15.88,39.88 15.88,40.47 JPUSBDOWN.10
VBIAS
  Top 0.2: R8.1 36.25,23.38 37.19,22.44 38.31,22.44 39.12,21.62 39.12,20.25 39.45,19.92 JPUSBETHERNET.5
VBUS_DET  (via drill 0.3 pad 1.02)
  Top 0.2: IC1.11 23.75,31.5 23.25,32 23.25,33.38 | 23.25,33.38 v23.25,33.88 | 23.25,33.38 20.5,36.12 11.75,36.12 10.25,37.62 8.57,37.62 JPGPIO.2
  Bottom 0.2: C28.1 23,34 23.25,33.75 v23.25,33.88 23.25,34
VDD18CORE
  Top 0.2: 24,17.88 24,18.12 23.88,18.25 | IC1.38 23.75,16.14 C14.2 | C15.2 21.28,31.47 21.75,31 IC1.15 21.75,32.12 21.66,32.22 21.53,32.22 | 11.44,32.56 9,30.12
  Top 0.406: 24,17.62 24,17.88
  Top 0.61: C14.2 23.82,16.32 24,16.5 24,17.62 | 21.53,32.22 20.75,33 18.5,33 | C16.2 17.86,33.11 20.12,33.62 | 20.12,33.62 11.88,33.62 11.88,33.12 12,33 | 20.12,33.62 20.62,33.12
  Top 0.813: 19.88,9.62 19.88,9.5 | 18.5,33 18.25,33
  Top 1.016: C14.2 22.82,15.06 C13.2 20.39,14.89 18.88,13.38 18.88,10.5 19.88,9.5 19.88,8.54 JPMISC.4 | 18.25,33 12,33 9.12,30.12 9,30.12 8.54,30.12 JPGPIO.5
  PCBnoRoute 0.61: 20.5,33.12 20.62,33.12 21.5,32.25 21.5,30.75 21.38,30.75 20.38,29.75 20.38,20.75 20.88,20.25 22.5,20.25 23.44,19.31 23.44,15.68
  PCBnoRoute 0.813: 18.5,33.12 20.5,33.12
  PCBnoRoute 1.016: JPGPIO.5 9.08,30.08 12.12,33.12 18.5,33.12 | 23.44,15.68 22.65,14.89 20.39,14.89 18.88,13.38 18.88,10.5 19.92,9.46 JPMISC.4
VDD18ETHPLL
  Top 0.2: IC1.48 28.75,19.38 29.62,18.5
  Top 0.406: 29.62,18.5 30.12,18
  Top 0.61: 30.12,18 30.62,17.5
  Top 0.813: 30.62,17.5 31,17.12
  Top 1.016: 31,17.12 31.75,16.37 C17.2 31.93,16.34 32.91,15.37 C19.2 34.56,13.9 L2.1
VDD18EXTERNBRIDGE
  Top 1.016: JPUSBETHERNET.12 41.42,37.62 39.38,37.62 38.12,36.38 38.12,35 37.19,34.06 L3.1 | L2.2 35.77,12.23 36,12 36.12,12 37.62,10.5 37.62,8.57 JPMISC.11
  PCBnoRoute 1.016: JPUSBETHERNET.12 41.42,37.62 39.38,37.62 38.12,36.38 38.12,28.38 35.25,25.5 35.25,20.12 33.38,18.25 33.38,14.75 37.62,10.5 37.62,8.57 JPMISC.11
VDD18USBPLL
  Top 0.2: IC1.62 31.25,27.75 32.25,28.75 | 33.09,29.25 C18.2
  Top 0.406: 32.25,28.75 32.5,29
  Top 0.61: 32.5,29 32.99,29.49 C18.2 33.33,29.87 C20.2
  Top 1.016: L3.2 34.31,30.87 C20.2
VDD33A  (via drill 0 pad 0.7, 0.3)
  Top 0.2: IC1.51 31.25,22.25 32.25,21.25 v32.75,21.25 | IC1.54 32.5,23.75 v32.75,23.5 | v33.25,25.5 33,25.25 IC1.57 | IC1.64 30.12,28.75 v30.38,29 | IC1.49 30.25,21.25 v30.5,21 | IC1.5 26.75,31.75 27.12,32.12 v27.12,32.75 | IC1.10 24.25,32.38 v24,32.62 | R8.2 33.31,23.38 v33.31,23.5
  Bottom 0.2: R1.2 35.65,24.75 35.62,24.75 | 35.62,24.75 33.25,24.75 v33.25,25.5 | R2.2 35.65,24.25 35.5,24.25 | 35.5,24.25 33.12,24.25 32.75,23.88 v32.75,23.5 | 35.5,24.25 35.62,24.38 35.62,24.75 | 35.62,24.75 35.38,24.5 35.38,24.38 35.25,24.5 32.88,24.5
  Bottom 1.016: R2.2 36.12,23.77 36.12,25.25 | R3.2 31.96,19.49 L1.1 32.54,18.91 | R4.2 33.32,18.12 32.54,18.91 | 32.54,18.91 35.09,18.91 35.12,18.88
  other vias: 33.31,23.25 33.31,23.25
  pour Bottom (isolate 0.305, no thermals): 24,33 24,29.5 29.5,29.5 29.5,21 33,17.5 33.62,17.5 33.62,30.12 30.88,33
XI  (via drill 0.3 pad 1.02)
  Top 0.2: IC1.61 31.5,27.25 32.38,28.12 33.5,28.12 35,29.62 v35.25,29.62
  Bottom 0.61: Q1.3 35.45,33.62 | 35.45,33.62 35.45,33.4 C22.2 | 35.45,33.62 33.91,32.09 R5.2 34.25,31.04 34.25,30.75 35.25,29.75 v35.25,29.62
XO  (via drill 0.3 pad 1.02)
  Top 0.2: IC1.60 31.75,26.75 32.62,27.62 34.5,27.62 v34.88,28
  Bottom 0.2: R5.1 32.71,29.67
  Bottom 0.61: v34.88,28 34.88,28.01 R5.1 32.71,30.29 30.38,32.62 30.38,33.38 30.75,33.75 30.75,34.31 Q1.1 31.23,34.79 C23.2

### Text on the board
bNames: matrixstorm.com | by S. Bärwolf | Oct. 2016 | rev. 1